# EAGLE schematic radio (EAGLE 9.6.2)
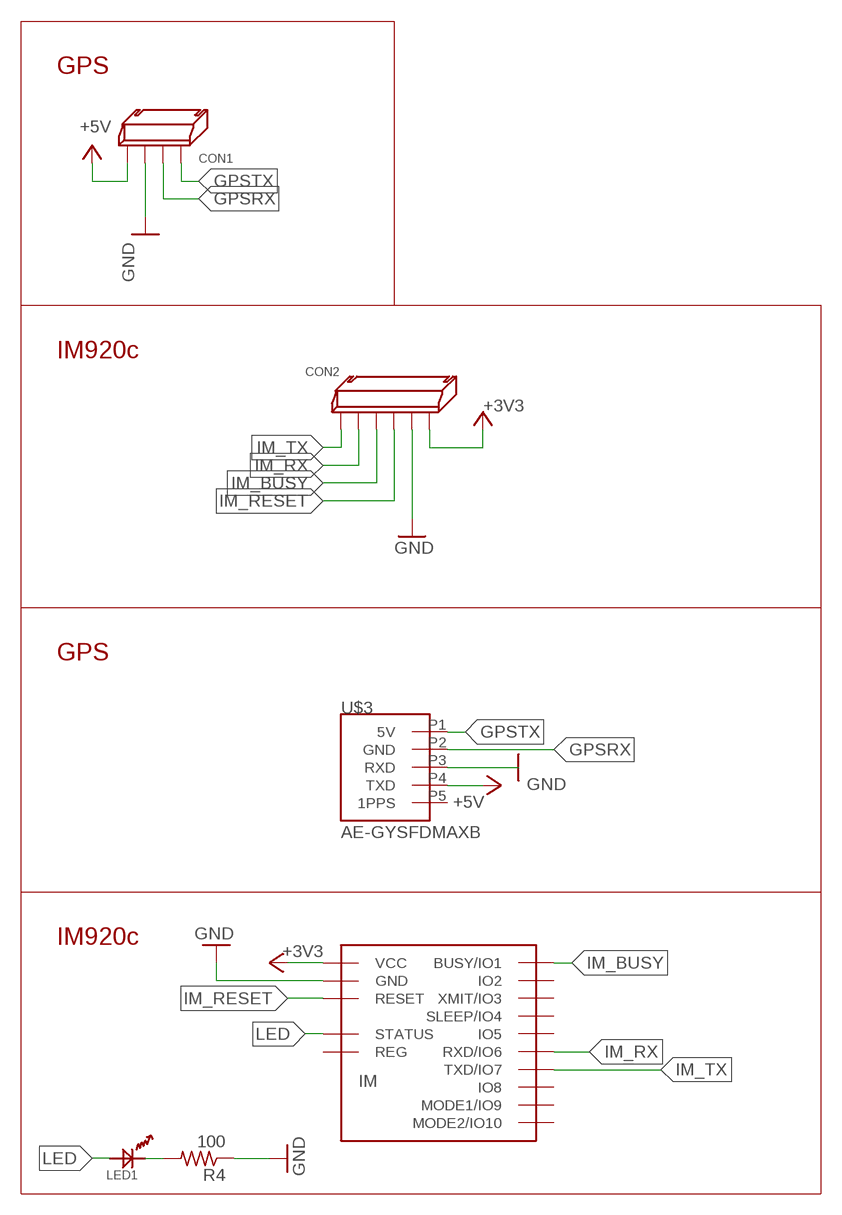
[diagram p0: schematic, sheet 1]

## Parts
CON1  4PIN_SIDE  [4PIN_SIDE]
CON2  6PIN_SIDE  [6PIN_SIDE]
IM  IM920C  [IM920C]
LED1  OSXX1608C1A  [OSXX1608C1A]
R4  100  R-US_R0603  [R0603]
U$3  AE-GYSFDMAXB  [AE-GYSFDMAXB]

## Nets
+3V3: CON2.P$6 IM.$P17(VCC)
+5V: CON1.P$2 U$3.P4(TXD)
GND: CON1.P$1 CON2.P$5 IM.$P18(GND) R4.1
GND1: U$3.P3(RXD) ; supply symbol labelled GND
GPSRX: CON1.P$3 U$3.P2(GND)
GPSTX: CON1.P$4 U$3.P1(5V)
IM_BUSY: CON2.P$3 IM.$P1(BUSY/IO1)
IM_RESET: CON2.P$4 IM.$P19(RESET)
IM_RX: CON2.P$2 IM.$P6(RXD/IO6)
IM_TX: CON2.P$1 IM.$P7(TXD/IO7)
LED: IM.$P15(STATUS) LED1.AN
N$3: LED1.CT R4.2
Unconnected: IM.$P2(IO2) IM.$P3(XMIT/IO3) IM.$P4(SLEEP/IO4) IM.$P5(IO5) IM.$P8(IO8) IM.$P9(MODE1/IO9) IM.$P10(MODE2/IO10) IM.$P16(REG) U$3.P5(1PPS)

## Notes on the sheet
- GPS
- IM920c
- GPS
- IM920c

## Library data of the parts
CON1 = XR Connector:4PIN_SIDE
CON2 = XR Connector:6PIN_SIDE
IM = IM920:IM920C
LED1 = Chip LED:OSXX1608C1A
R4 = rcl:R-US_: RESISTOR, American symbol; SPICEPREFIX: R
U$3 = AE-GYSFDMAXB:AE-GYSFDMAXB